# EAGLE design Boron485 (EAGLE 7.7.0)
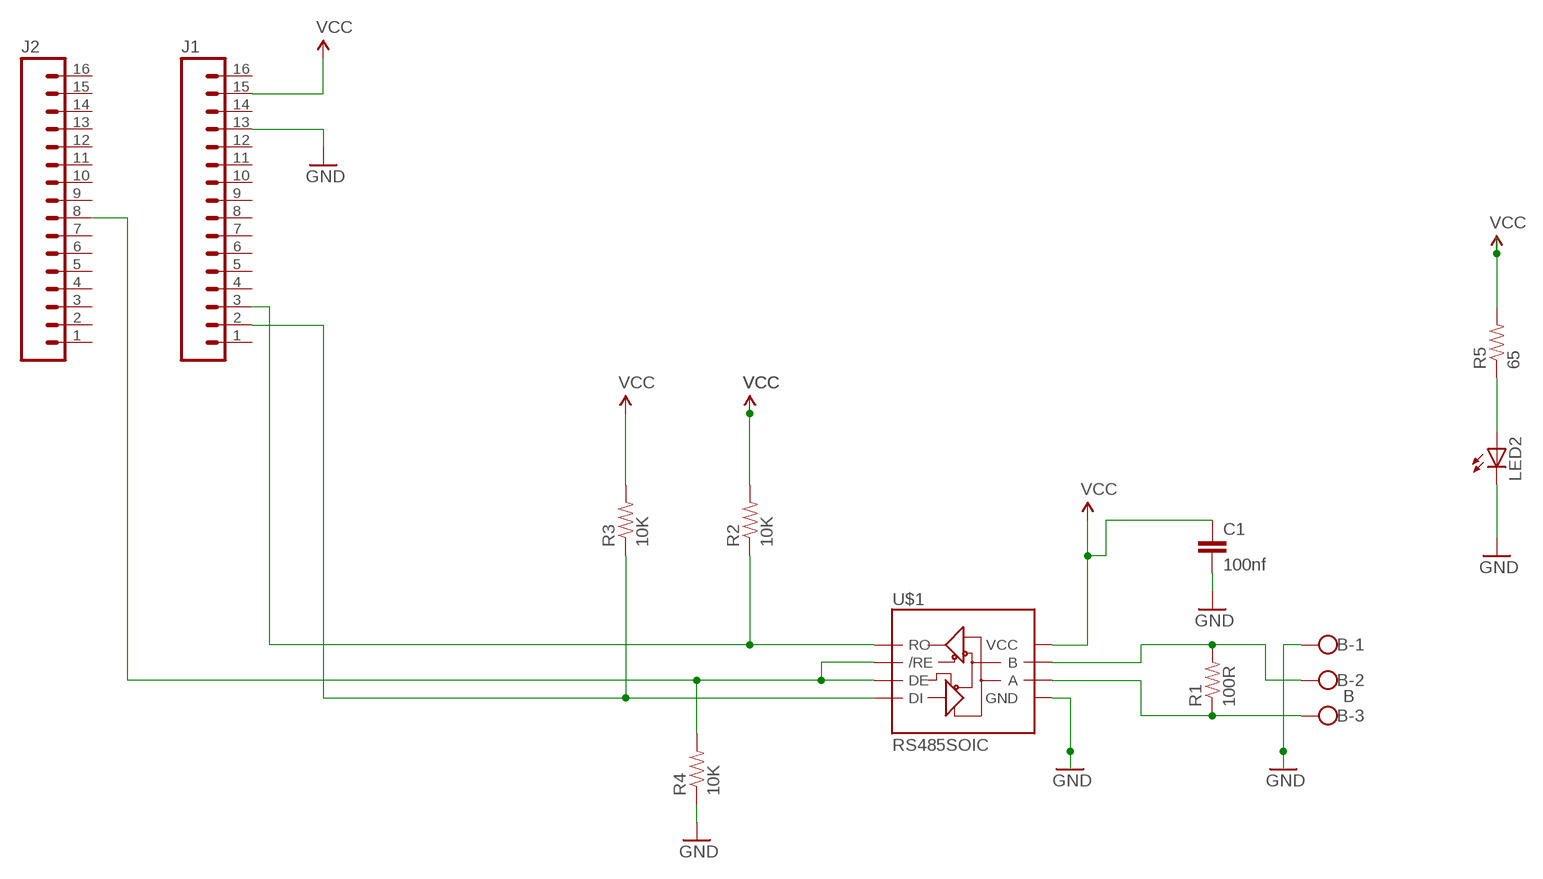
[diagram p0: schematic, sheet 1]

## Parts
B  B  W237-103  [W237-103]
C1  100nf  C-EUC0603  [C0603]
J1  M16PTH  [1X16]
J2  M16PTH  [1X16]
LED2  LED_E  [LED_1206]
R1  100R  RESISTOR0603-RES  [0603-RES]
R2  10K  RESISTOR0603-RES  [0603-RES]
R3  10K  RESISTOR0603-RES  [0603-RES]
R4  10K  RESISTOR0603-RES  [0603-RES]
R5  65  RESISTOR0603-RES  [0603-RES]
U$1  RS485SOIC  [SO08]

## Nets
A: B.3 R1.1 U$1.6(A)
B: B.2 R1.2 U$1.7(B)
GND: B.1 C1.2 J1.13 LED2.C R4.1 U$1.5(GND)
R2LED: LED2.A R5.1
RTS: J2.8 R4.2 U$1.2(/RE) U$1.3(DE)
RX: J1.3 R2.1 U$1.1(RO)
TX: J1.2 R3.1 U$1.4(DI)
VCC: C1.1 J1.15 R2.2 R3.2 R5.2 U$1.8(VCC)
Unconnected: J1.1 J1.4 J1.5 J1.6 J1.7 J1.8 J1.9 J1.10 J1.11 J1.12 J1.14 J1.16 J2.1 J2.2 J2.3 J2.4 J2.5 J2.6 J2.7 J2.9 J2.10 J2.11 J2.12 J2.13 J2.14 J2.15 J2.16

## Library data of the parts
B = con-wago-500:W237-103: WAGO SCREW CLAMP; MPN: 237-103; OC_FARNELL: unknown; OC_NEWARK: 18M7116
C1 = resistor:C-EU: CAPACITOR, European symbol
J1 J2 = SparkFun-Connectors:M16: 1x16 .1" header
LED2 = eagle-ltspice:LED_E: LED Source: http://www.osram.convergy.de Source: www.luxeon.com Source: www.kingbright.com; SPICEMODEL: NONE; SPICEPREFIX: D; SPICETYPE: diode
R1-R5 = SparkFun-Passives:RESISTOR: Resistor Basic schematic elements and footprints for 0603, 1206, and PTH resistors.
U$1 = SparkFun-DigitalIC:RS485: RS485 transceiver

## Board
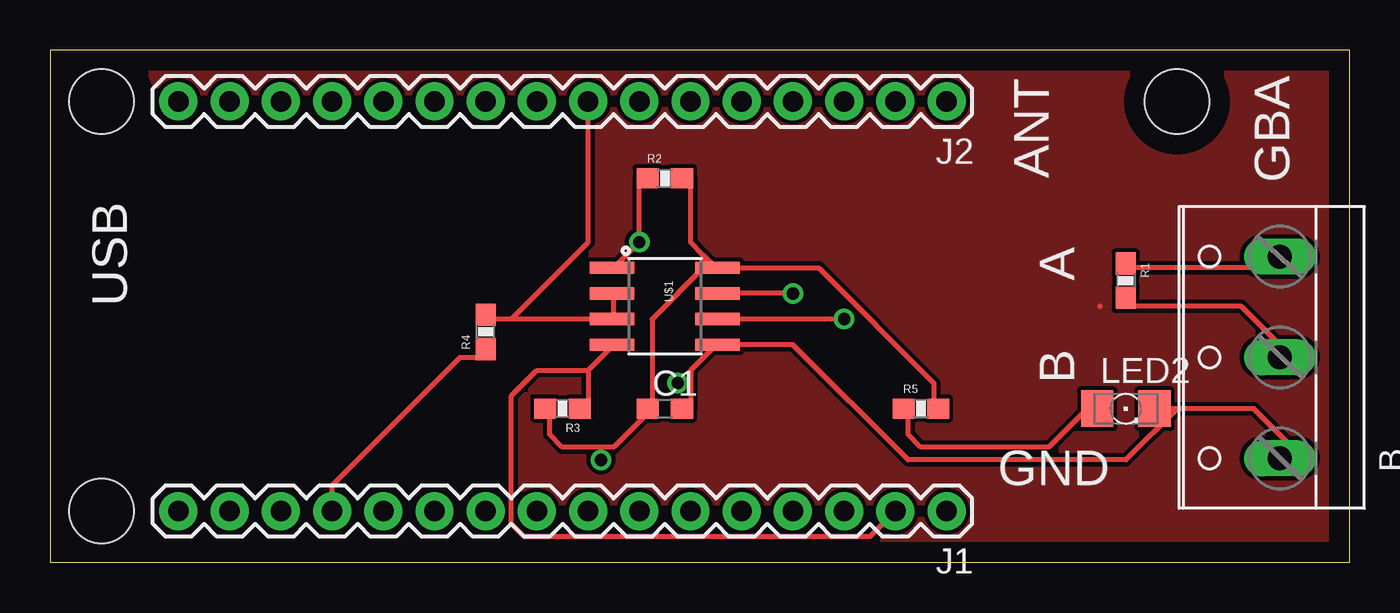
[diagram p1: board, top side]
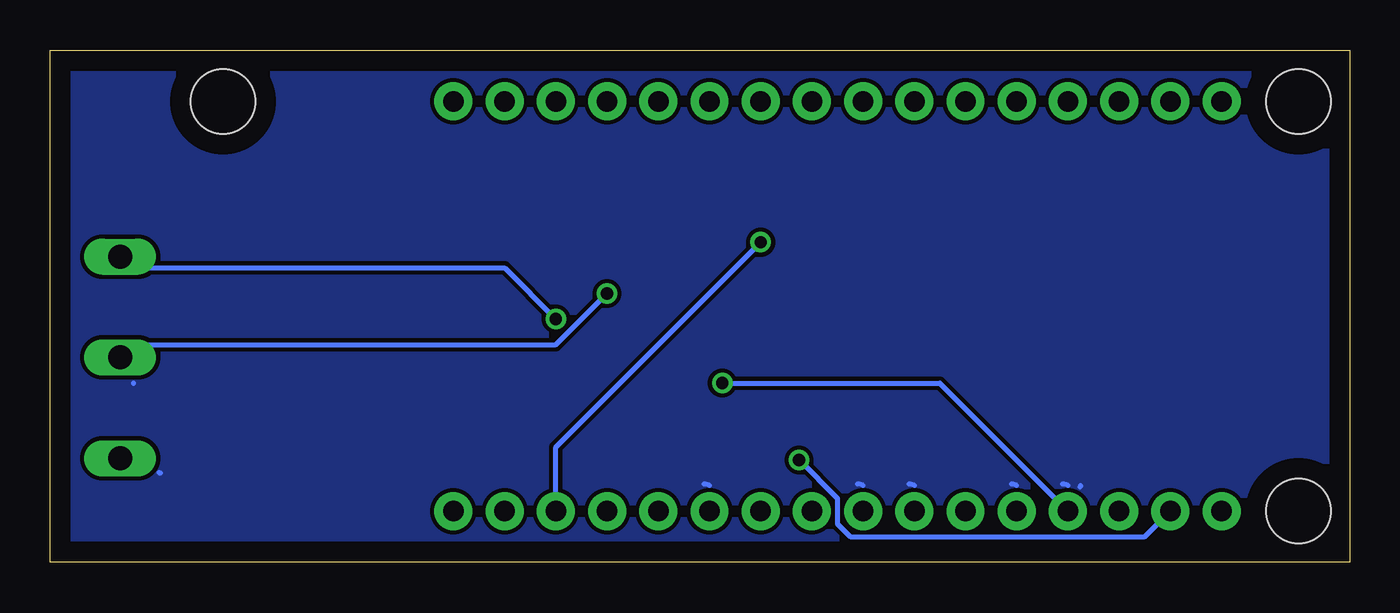
[diagram p2: board, bottom side, seen from below]

Size 64.44 x 25.39 mm. Coordinates in mm from the lower left corner, seen from the top.
Outline: 0,0 64.44,0 64.44,25.39 0,25.39 0,0
Copper layers (1*16): Top 0.035mm / dielectric 1.5mm / Bottom 0.035mm
Design rules "default": minimum track width 10mil, minimum drill 24mil, track to track 8mil, track to pad 8mil, pad to pad 8mil, via to via 8mil, smd to smd 8mil, copper to edge 40mil, drill to drill 8mil, minimum pad ring 10mil, minimum via ring 8mil, stop-mask expansion 4mil, vias tented up to drill 0mil, thermal gap 10mil
Holes 3.2 mm at 2.54,22.86 2.54,2.54 55.88,22.86

### Footprints (pad centres in the part's own frame; a part is rotated, then mirrored left to right if it is on the bottom)
W237-103 = drill 1.194 long: 1 -5,-1.29; 2 0,-1.29; 3 5,-1.29
C0603 = smd 1.1 x 1: 1 -0.85,0; 2 0.85,0
1X16 = drill 1.016 pad 1.88: 1 0,0; 2 2.54,0; 3 5.08,0; 4 7.62,0; 5 10.16,0; 6 12.7,0; 7 15.24,0; 8 17.78,0; 9 20.32,0; 10 22.86,0; 11 25.4,0; 12 27.94,0; 13 30.48,0; 14 33.02,0; 15 35.56,0; 16 38.1,0
LED_1206 = smd 1.6 x 1.803: A -1.422,0; C 1.422,0
0603-RES = smd 1.1 x 1: 1 -0.85,0; 2 0.85,0
SO08 = smd 0.61 x 2.21: 1 -1.905,-2.616; 2 -0.635,-2.616; 3 0.635,-2.616; 4 1.905,-2.616; 5 1.905,2.616; 6 0.635,2.616; 7 -0.635,2.616; 8 -1.905,2.616

### Placement (x,y rotation side)
B  59.69,10.16 90 top
C1  30.48,7.62 0 top
J1  44.45,2.54 180 top
J2  44.45,22.86 180 top
LED2  53.34,7.62 0 top
R1  53.34,13.97 270 top
R2  30.48,19.05 0 top
R3  25.4,7.62 180 top
R4  21.59,11.43 90 top
R5  43.18,7.62 0 top
U$1  30.48,12.7 270 top

### Tracks (layer width: path | path; a pad name or v marks a point on that pad's centre or on a via)
A  (via drill 0.61)
  Top 0.254: R1.1 53.34,14.61 60.96,14.61 B.3 | v39.37,12.06 U$1.6
  Bottom 0.254: v39.37,12.06 41.91,14.61 60.96,14.61 B.3
B  (via drill 0.61)
  Top 0.254: R1.2 53.34,12.7 59.05,12.7 61.59,10.16 B.2 | v36.83,13.34 U$1.7
  Bottom 0.254: v36.83,13.34 39.37,10.79 60.33,10.79 60.96,10.16 B.2
GND  (via drill 0.61)
  Top 0.254: J1.13 13.97,3.81 20.32,10.16 21.59,10.16 R4.1 | 31.75,8.89 31.75,9.53 33.02,10.79 U$1.5 36.83,10.79 42.55,5.08 53.34,5.08 55.88,7.62 | 31.75,8.89 31.75,7.62 C1.2 | 55.88,7.62 59.69,7.62 61.59,5.71 B.1 | 55.88,7.62 LED2.C | 31.75,8.89 v31.11,8.89
  Bottom 0.254: J1.13 20.32,8.89 v31.11,8.89
N$2
  Bottom 0.254: 60.33,8.89 60.33,8.86 | 13.97,3.81 14.24,3.89 | 21.59,3.81 21.86,3.89 | 59.05,4.45 58.98,4.42 | 31.75,3.81 32.02,3.89 | 13.34,3.81 13.36,3.75 | 24.13,3.81 24.4,3.89 | 16.51,3.81 16.78,3.89
  pour Bottom: -5.08,27.94 64.77,27.94 64.77,21.59 64.77,0 -5.08,0
N$3
  Top 0.254: 52.07,12.7 52.06,12.71
  pour Top: -5.08,27.94 64.77,27.94 64.77,0 -5.08,0
R2LED
  Top 0.254: R5.1 42.55,7.62 42.55,6.35 43.18,5.71 49.53,5.71 51.44,7.62 LED2.A
RTS
  Top 0.254: 22.86,12.06 U$1.3 27.94,12.06 27.94,13.34 U$1.2 | 22.86,12.06 21.59,12.06 R4.2 | J2.8 26.67,15.88 22.86,12.06
RX  (via drill 0.61)
  Top 0.254: R2.1 29.21,19.05 v29.21,15.88 27.94,14.61 U$1.1
  Bottom 0.254: v29.21,15.88 39.37,5.71 J1.3
TX
  Top 0.254: 26.67,9.53 26.67,7.62 R3.1 | 26.67,9.53 27.94,10.79 U$1.4 | 26.67,9.53 24.13,9.53 22.86,8.26 22.86,1.91 23.49,1.27 40.64,1.27 J1.2
VCC  (via drill 0.61)
  Top 0.254: 27.3,5.71 27.94,5.71 29.84,7.62 | 27.3,5.71 25.4,5.71 24.77,6.35 24.77,7.62 R3.2 | 32.38,15.24 33.02,14.61 U$1.8 38.1,14.61 43.81,8.89 43.81,7.62 R5.2 | 32.38,15.24 31.75,15.88 31.75,19.05 R2.2 | 29.84,7.62 29.84,12.06 32.38,14.61 32.38,15.24 | 29.84,7.62 C1.1 | 27.3,5.71 v27.3,5.08
  Bottom 0.254: J1.15 10.16,1.27 24.77,1.27 25.4,1.91 25.4,3.17 v27.3,5.08

### Text on the board
_tsilk: GBA | ANT | A | USB | B | GND